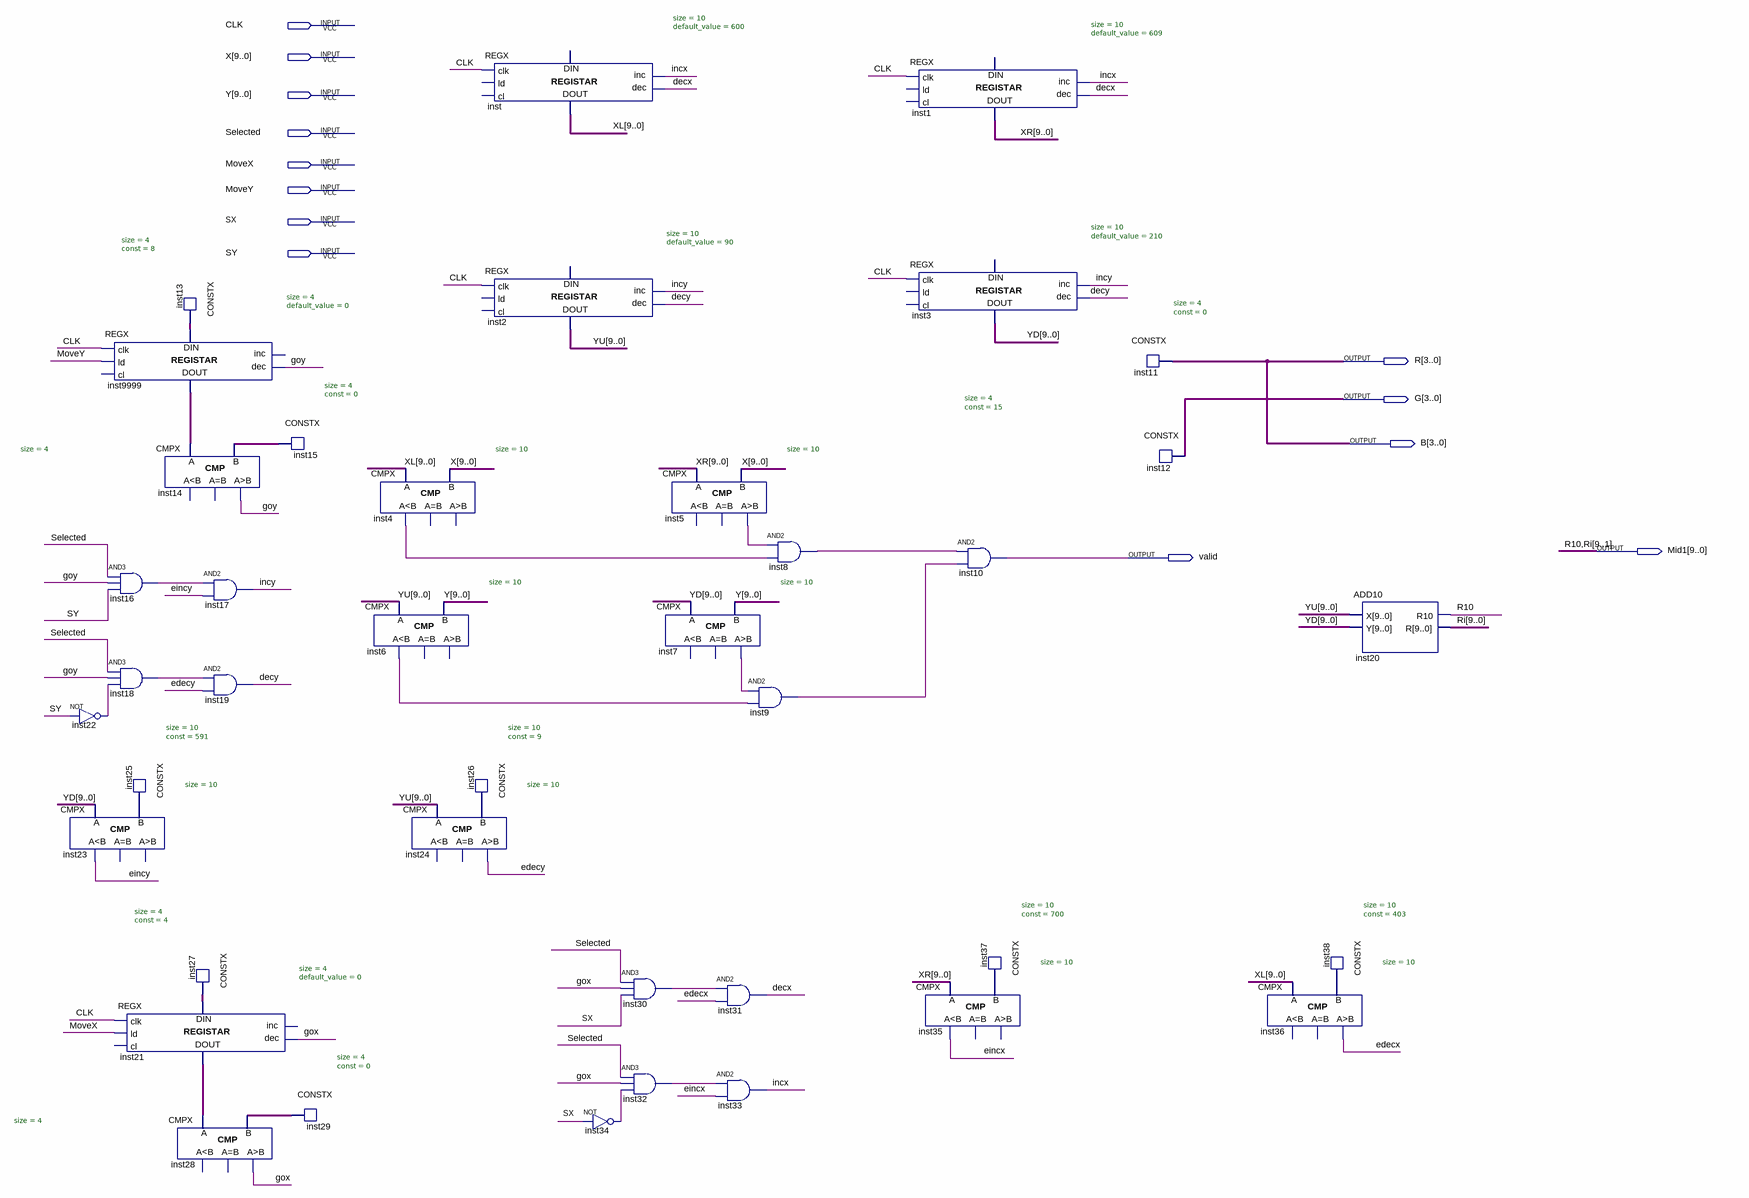
[diagram p0: schematic sheet]
// Quartus schematic Nap1.bdf as structural Verilog: 40 symbols, 13 pins
module Nap1 (
  input  CLK,
  input  [9:0] X,
  input  [9:0] Y,
  input  Selected,
  input  MoveX,
  input  MoveY,
  input  SX,
  input  SY,
  output [3:0] R,
  output [3:0] G,
  output [3:0] B,
  output [9:0] Mid1,
  output valid
);

  wire decx, decy, edecx, edecy, eincx, eincy, gox, goy, incx, incy, inst4_ls, inst5_gr, inst6_ls, inst7_gr,
       inst8_out, inst9_out, inst16_out, inst18_out, inst22_out, inst30_out, inst32_out, inst34_out;
  wire [0:0] Ri;
  wire [3:0] inst13_data, inst15_data, inst21_data_out, inst27_data, inst29_data, inst9999_data_out;
  wire [9:0] inst25_data, inst26_data, inst37_data, inst38_data, XL, XR, YD, YU;

  not inst22 (inst22_out, SY);
  CMPX #(.size(10)) inst23 (.A(YD), .B(inst25_data), .ls(eincy));  // open: eq, gr
  REGX #(.size(4), .default_value(0)) inst9999 (
    .clk(CLK), .ld(MoveY), .dec(goy), .data_in(inst13_data), .data_out(inst9999_data_out));  // open: cl, inc
  and inst16 (inst16_out, Selected, goy, SY);
  and inst18 (inst18_out, Selected, goy, inst22_out);
  CONSTX #(.size(10), .\const (591)) inst25 (.data(inst25_data));
  REGX #(.size(4), .default_value(0)) inst21 (
    .clk(CLK), .ld(MoveX), .dec(gox), .data_in(inst27_data), .data_out(inst21_data_out));  // open: cl, inc
  CONSTX #(.size(4), .\const (8)) inst13 (.data(inst13_data));
  CMPX #(.size(4)) inst14 (.A(inst9999_data_out), .B(inst15_data), .gr(goy));  // open: ls, eq
  CMPX #(.size(4)) inst28 (.A(inst21_data_out), .B(inst29_data), .gr(gox));  // open: ls, eq
  and inst17 (incy, inst16_out, eincy);
  and inst19 (decy, inst18_out, edecy);
  CONSTX #(.size(4), .\const (4)) inst27 (.data(inst27_data));
  CONSTX #(.size(4), .\const (0)) inst15 (.data(inst15_data));
  CONSTX #(.size(4), .\const (0)) inst29 (.data(inst29_data));
  CMPX #(.size(10)) inst4 (.A(XL), .B(X), .ls(inst4_ls));  // open: eq, gr
  CMPX #(.size(10)) inst6 (.A(YU), .B(Y), .ls(inst6_ls));  // open: eq, gr
  CMPX #(.size(10)) inst24 (.A(YU), .B(inst26_data), .gr(edecy));  // open: ls, eq
  CONSTX #(.size(10), .\const (9)) inst26 (.data(inst26_data));
  REGX #(.size(10), .default_value(600)) inst (
    .clk(CLK), .inc(incx), .dec(decx), .data_out(XL));  // open: ld, cl, data_in
  REGX #(.size(10), .default_value(90)) inst2 (
    .clk(CLK), .inc(incy), .dec(decy), .data_out(YU));  // open: ld, cl, data_in
  and inst30 (inst30_out, Selected, gox, SX);
  and inst32 (inst32_out, Selected, gox, inst34_out);
  not inst34 (inst34_out, SX);
  CMPX #(.size(10)) inst5 (.A(XR), .B(X), .gr(inst5_gr));  // open: ls, eq
  CMPX #(.size(10)) inst7 (.A(YD), .B(Y), .gr(inst7_gr));  // open: ls, eq
  and inst31 (decx, inst30_out, edecx);
  and inst33 (incx, inst32_out, eincx);
  and inst8 (inst8_out, inst5_gr, inst4_ls);
  and inst9 (inst9_out, inst7_gr, inst6_ls);
  REGX #(.size(10), .default_value(609)) inst1 (
    .clk(CLK), .inc(incx), .dec(decx), .data_out(XR));  // open: ld, cl, data_in
  REGX #(.size(10), .default_value(210)) inst3 (
    .clk(CLK), .inc(incy), .dec(decy), .data_out(YD));  // open: ld, cl, data_in
  CMPX #(.size(10)) inst35 (.A(XR), .B(inst37_data), .ls(eincx));  // open: eq, gr
  and inst10 (valid, inst8_out, inst9_out);
  CONSTX #(.size(10), .\const (700)) inst37 (.data(inst37_data));
  CONSTX #(.size(4), .\const (0)) inst11 (.data(B));
  CONSTX #(.size(4), .\const (15)) inst12 (.data(G));
  CMPX #(.size(10)) inst36 (.A(XL), .B(inst38_data), .gr(edecx));  // open: ls, eq
  CONSTX #(.size(10), .\const (403)) inst38 (.data(inst38_data));
  ADD10 inst20 (.X(YU), .Y(YD), .R10(Mid1[9]), .R({Mid1[8:0], Ri[0]}));

  assign R = B;

  // Other names for the same wires on the sheet: R10 = Mid1[9]; Ri[9:1] = Mid1[8:0]
endmodule
